# EAGLE design board (EAGLE 7.1.0)
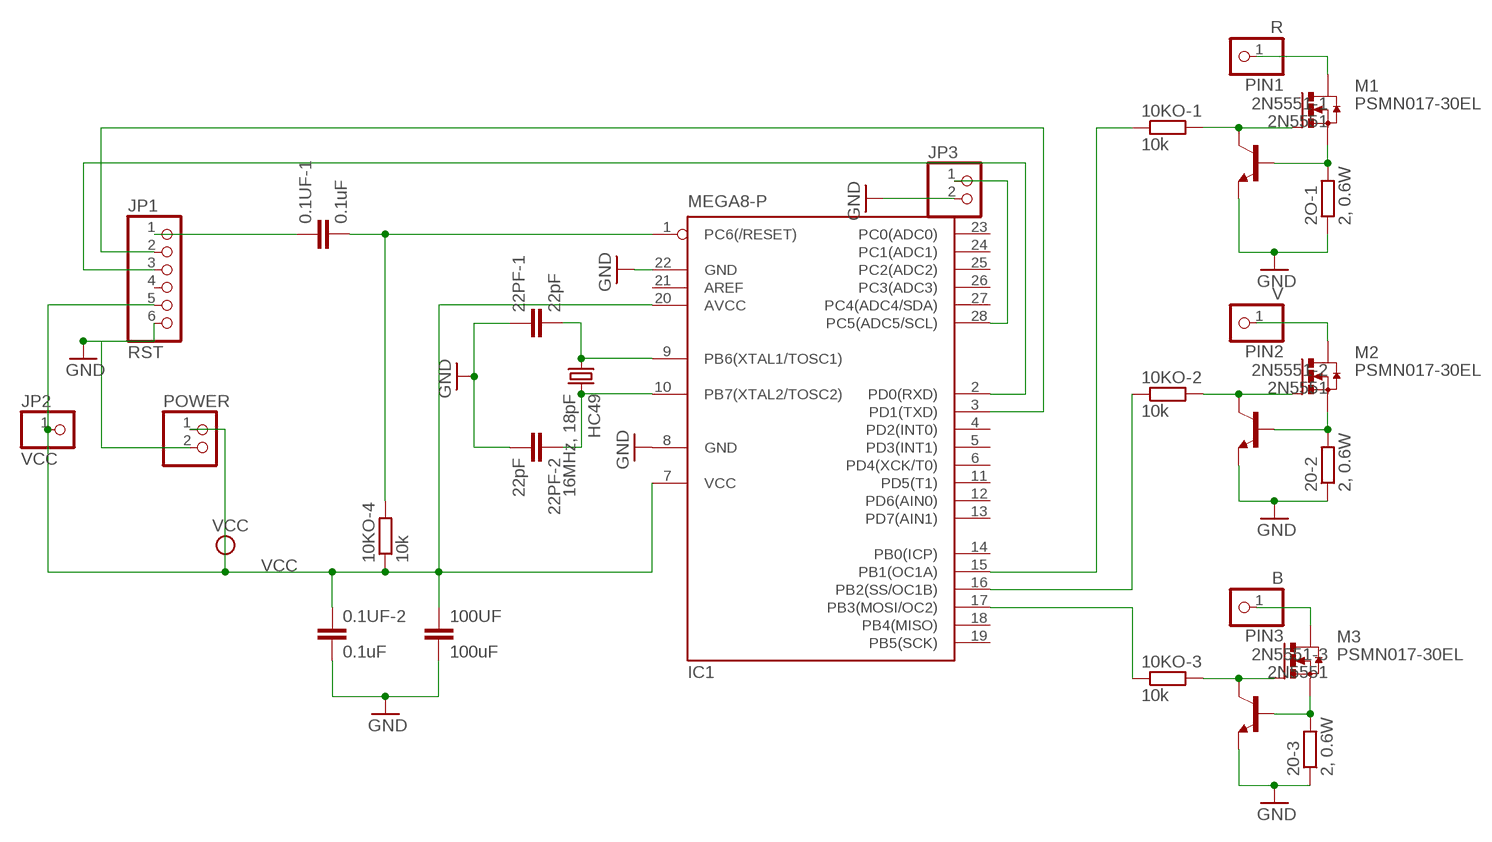
[diagram p0: schematic, sheet 1]

## Parts
0.1UF-1  0.1uF  C-EU025-030X050  [C025-030X050]
0.1UF-2  0.1uF  C-EU025-030X050  [C025-030X050]
2N5551-1  2N5551  2N5551-NPN-TO92-CBE  [TO92-CBE]
2N5551-2  2N5551  2N5551-NPN-TO92-CBE  [TO92-CBE]
2N5551-3  2N5551  2N5551-NPN-TO92-CBE  [TO92-CBE]
2O-1  2, 0.6W  R-EU_0309/V  [0309V]
10KO-1  10k  R-EU_0207/2V  [0207/2V]
10KO-2  10k  R-EU_0207/2V  [0207/2V]
10KO-3  10k  R-EU_0207/2V  [0207/2V]
10KO-4  10k  R-EU_0207/2V  [0207/2V]
20-2  2, 0.6W  R-EU_0309/V  [0309V]
20-3  2, 0.6W  R-EU_0309/V  [0309V]
22PF-1  22pF  C-EU025-030X050  [C025-030X050]
22PF-2  22pF  C-EU025-030X050  [C025-030X050]
100UF  100uF  C-EU025-050X050  [C025-050X050]
HC49  16MHz, 18pF  CRYSTALHC49S  [HC49/S]
IC1  MEGA8-P  [DIL28-3]
JP1  RST  PINHD-1X6  [1X06]
JP2  VCC  PINHD-1X1  [1X01]
JP3  PINHD-1X2  [1X02]
M1  PSMN017-30EL  PSMN017-30ELL-V  [TO262-V]
M2  PSMN017-30EL  PSMN017-30ELL-V  [TO262-V]
M3  PSMN017-30EL  PSMN017-30ELL-V  [TO262-V]
PIN1  R  PINHD-1X1  [1X01]
PIN2  V  PINHD-1X1  [1X01]
PIN3  B  PINHD-1X1  [1X01]
POWER  PINHD-1X2  [1X02]

## Nets
GND: 0.1UF-2.2 2N5551-1.E 2N5551-2.E 2N5551-3.E 2O-1.1 20-2.1 20-3.1 22PF-1.1 22PF-2.2 100UF.2 IC1.8(GND) IC1.22(GND) JP1.6 JP3.2 POWER.2
N$1: 22PF-1.2 HC49.1 IC1.9(PB6(XTAL1/TOSC1))
N$2: 22PF-2.1 HC49.2 IC1.10(PB7(XTAL2/TOSC2))
N$3: 0.1UF-1.1 JP1.1
N$4: 2N5551-2.C 10KO-2.2 M2.1(G)
N$5: 0.1UF-1.2 10KO-4.2 IC1.1(PC6(/RESET))
N$6: 2N5551-1.C 10KO-1.2 M1.1(G)
N$7: 2N5551-2.B 20-2.2 M2.3(S)
N$8: 2N5551-1.B 2O-1.2 M1.3(S)
N$9: IC1.3(PD1(TXD)) JP1.2
N$10: 2N5551-3.C 10KO-3.2 M3.1(G)
N$11: 2N5551-3.B 20-3.2 M3.3(S)
N$12: IC1.2(PD0(RXD)) JP1.3
N$13: 10KO-1.1 IC1.15(PB1(OC1A))
N$14: 10KO-2.1 IC1.16(PB2(SS/OC1B))
N$15: 10KO-3.1 IC1.17(PB3(MOSI/OC2))
N$16: M1.2(D) PIN1.1
N$17: M2.2(D) PIN2.1
N$18: M3.2(D) PIN3.1
N$19: IC1.28(PC5(ADC5/SCL)) JP3.1
VCC: 0.1UF-2.1 10KO-4.1 100UF.1 IC1.7(VCC) IC1.20(AVCC) JP1.5 JP2.1 POWER.1
Unconnected: IC1.4(PD2(INT0)) IC1.5(PD3(INT1)) IC1.6(PD4(XCK/T0)) IC1.11(PD5(T1)) IC1.12(PD6(AIN0)) IC1.13(PD7(AIN1)) IC1.14(PB0(ICP)) IC1.18(PB4(MISO)) IC1.19(PB5(SCK)) IC1.21(AREF) IC1.23(PC0(ADC0)) IC1.24(PC1(ADC1)) IC1.25(PC2(ADC2)) IC1.26(PC3(ADC3)) IC1.27(PC4(ADC4/SDA)) JP1.4

## Library data of the parts
0.1UF-1 0.1UF-2 22PF-1 22PF-2 100UF = rcl:C-EU: CAPACITOR, European symbol
2N5551-1-2N5551-3 = transistor:*-NPN-: NPN Transistror BF959 corrected 2008.03.06
2O-1 10KO-1-10KO-4 20-2 20-3 = rcl:R-EU_: RESISTOR, European symbol
HC49 = crystal:CRYSTAL: CRYSTAL; OC_FARNELL: 1667008; OC_NEWARK: unknown
IC1 = atmel:MEGA8-P: MICROCONTROLLER 8 Kbytes FLASH, 1 kbytes SRAM, 512 bytes EEPROM, USART, 4-channel 10 bit ADC, 2-channel 8 bit ADC Pin compatible with Atmega48, ATMega88, ATMega168 Source: avr.lbr; OC_FARNELL: unknown; OC_NEWARK: unknown
JP1 = pinhead:PINHD-1X6: PIN HEADER
JP2 PIN1-PIN3 = pinhead:PINHD-1X1: PIN HEADER
JP3 POWER = pinhead:PINHD-1X2: PIN HEADER
M1-M3 = hackens:PSMN017-30EL: MOSFET CANAL N 30V 32A I2PAK Source : http://www.farnell.com/datasheets/1596017.pdf

## Board
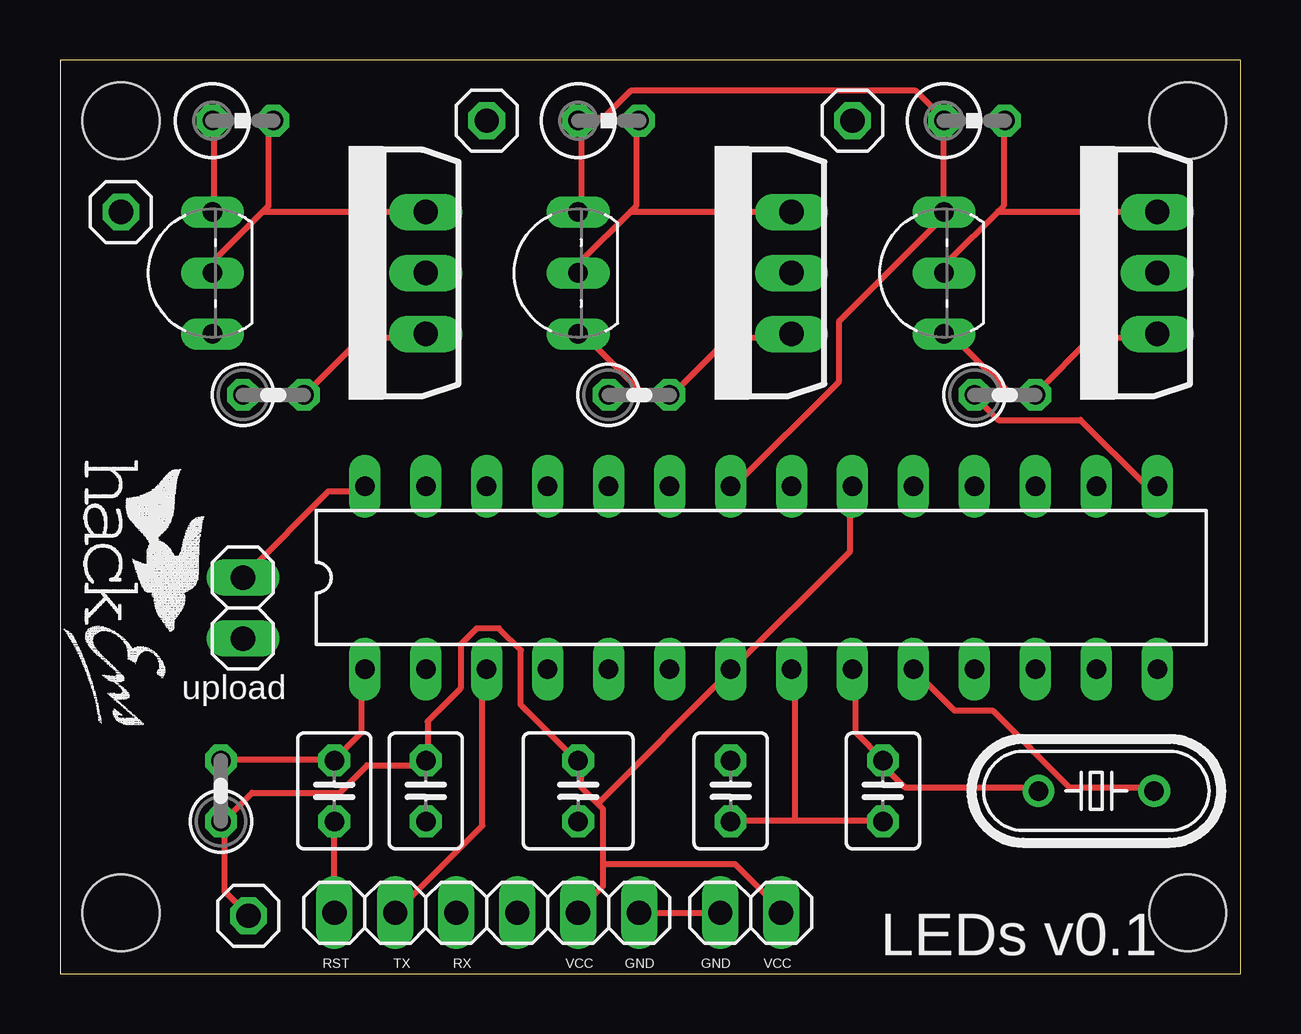
[diagram p1: board, top side]
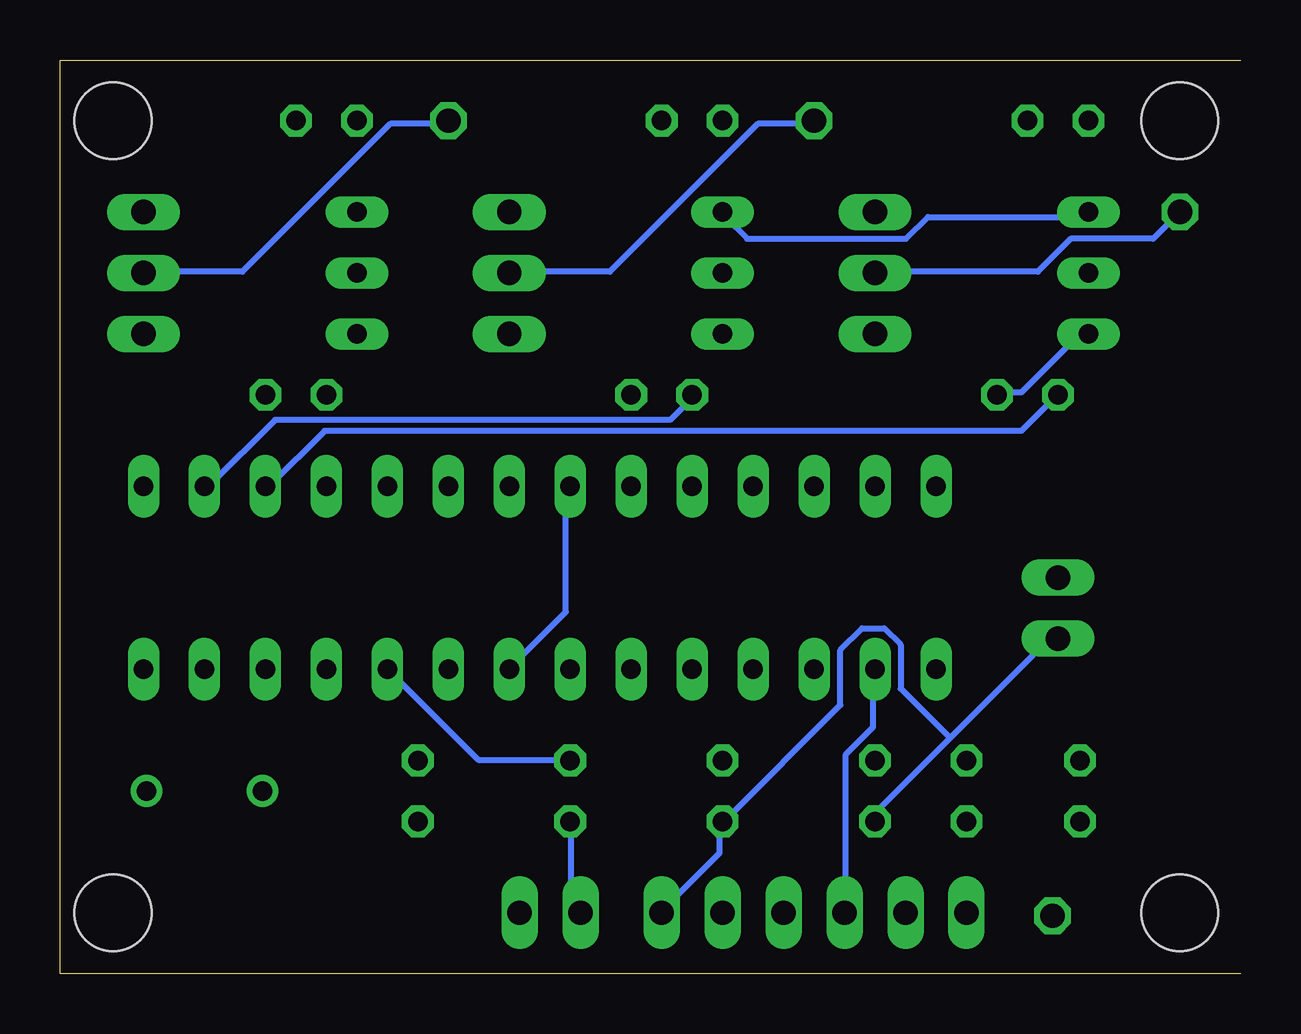
[diagram p2: board, bottom side, seen from below]

Size 49.2 x 38.09 mm. Coordinates in mm from the lower left corner, seen from the top.
Outline: 0,0 49.2,0 49.2,38.09 0,38.09
Copper layers (1*16): Top 0.035mm / dielectric 1.5mm / Bottom 0.035mm
Design rules "default": minimum track width 10mil, minimum drill 24mil, track to track 8mil, track to pad 8mil, pad to pad 8mil, via to via 8mil, smd to smd 8mil, copper to edge 40mil, drill to drill 8mil, minimum pad ring 10mil, minimum via ring 8mil, stop-mask expansion 4mil, vias tented up to drill 0mil, thermal gap 10mil
Holes 3.2 mm at 46.99,35.56 46.99,2.54 2.54,2.54 2.54,35.56

### Footprints (pad centres in the part's own frame; a part is rotated, then mirrored left to right if it is on the bottom)
C025-030X050 = drill 0.813 octagon: 1 -1.27,0; 2 1.27,0
TO92-CBE = drill 0.813 long: B 0,0; C -2.54,0; E 2.54,0
0309V = drill 0.813 octagon: 1 -1.27,0; 2 1.27,0
0207/2V = drill 0.813 octagon: 1 -1.27,0; 2 1.27,0
C025-050X050 = drill 0.813 octagon: 1 -1.27,0; 2 1.27,0
HC49/S = drill 0.813: 1 -2.413,0; 2 2.413,0
DIL28-3 = drill 0.813 long: 1 -16.51,-3.81; 2 -13.97,-3.81; 3 -11.43,-3.81; 4 -8.89,-3.81; 5 -6.35,-3.81; 6 -3.81,-3.81; 7 -1.27,-3.81; 8 1.27,-3.81; 9 3.81,-3.81; 10 6.35,-3.81; 11 8.89,-3.81; 12 11.43,-3.81; 13 13.97,-3.81; 14 16.51,-3.81; 15 16.51,3.81; 16 13.97,3.81; 17 11.43,3.81; 18 8.89,3.81; 19 6.35,3.81; 20 3.81,3.81; 21 1.27,3.81; 22 -1.27,3.81; 23 -3.81,3.81; 24 -6.35,3.81; 25 -8.89,3.81; 26 -11.43,3.81; 27 -13.97,3.81; 28 -16.51,3.81
1X06 = drill 1.016 long: 1 -6.35,0; 2 -3.81,0; 3 -1.27,0; 4 1.27,0; 5 3.81,0; 6 6.35,0
1X01 = drill 1.016 octagon: 1 0,0
1X02 = drill 1.016 long: 1 -1.27,0; 2 1.27,0
TO262-V = drill 1.016 long: 1 -2.54,0; 2 0,0; 3 2.54,0

### Placement (x,y rotation side)
0.1UF-1  11.43,7.62 90 top
0.1UF-2  15.24,7.62 270 top
2N5551-1  36.83,29.21 90 top
2N5551-2  21.59,29.21 90 top
2N5551-3  6.35,29.21 90 top
2O-1  38.1,35.56 0 top
10KO-1  39.37,24.13 0 top
10KO-2  24.13,24.13 0 top
10KO-3  8.89,24.13 0 top
10KO-4  6.71,7.62 90 top
20-2  22.86,35.56 0 top
20-3  7.62,35.56 0 top
22PF-1  34.29,7.62 90 top
22PF-2  27.94,7.62 270 top
100UF  21.59,7.62 270 top
HC49  43.18,7.62 0 top
IC1  29.21,16.51 0 top
JP1  17.78,2.54 0 top
JP2  7.85,2.41 0 top
JP3  7.62,15.24 270 top
M1  45.72,29.21 90 top
M2  30.48,29.21 90 top
M3  15.24,29.21 90 top
PIN1  33.02,35.56 0 top
PIN2  17.78,35.56 0 top
PIN3  2.54,31.75 0 top
POWER  28.78,2.54 180 top
U$1  [HACKENS-LOGO]  0,21.59 270 top

### Tracks (layer width: path | path; a pad name or v marks a point on that pad's centre or on a via)
GND
  Top 0.254: 2N5551-3.E 6.4,31.77 6.4,35.43 20-3.1 | 2N5551-2.E 21.72,31.77 21.72,35.43 20-2.1 21.72,35.66 22.63,35.66 23.77,36.8 35.66,36.8 36.8,35.66 2O-1.1 36.8,35.43 36.8,31.77 2N5551-1.E 36.8,31.55 32.46,27.2 32.46,24.69 28.12,20.34 IC1.22 | 30.63,6.4 28.12,6.4 22PF-2.2 | 30.63,6.4 34.29,6.4 22PF-1.1 | 30.63,6.4 30.63,12.57 IC1.8 | JP1.6 24.23,2.52 27.43,2.52 POWER.2
  Bottom 0.254: 2N5551-3.E 6.4,31.55 13.03,31.55 13.95,30.63 20.57,30.63 21.49,31.55 2N5551-2.E | 12.12,9.83 7.77,14.17 JP3.2 | 12.12,9.83 15.09,6.86 15.09,6.4 0.1UF-2.2 | JP1.6 24,2.74 21.72,5.03 21.72,6.17 100UF.2 21.49,6.4 16.69,11.2 16.69,13.49 15.77,14.4 14.86,14.4 14.17,13.72 14.17,11.89 12.12,9.83 | 22PF-2.2 27.89,6.17 27.89,2.97 27.66,2.74 POWER.2 | IC1.22 28.12,20.12 28.12,15.09 30.4,12.8 IC1.8
N$1
  Top 0.254: IC1.9 33.15,12.57 33.15,10.06 34.29,8.91 22PF-1.2 34.29,8.69 35.2,7.77 40.69,7.77 HC49.1
N$2
  Top 0.254: HC49.2 45.49,7.77 42.06,7.77 38.86,10.97 37.26,10.97 35.66,12.57 IC1.10
  Bottom 0.254: IC1.10 31.77,8.91 28.12,8.91 22PF-2.1
N$3
  Top 0.254: JP1.1 0.1UF-1.1
N$4
  Top 0.254: 2N5551-2.C 21.72,26.75 24.23,24.23 25.38,24.23 10KO-2.2 25.6,24.23 27.89,26.52 30.4,26.52 M2.1
N$5
  Top 0.254: 11.43,8.91 6.86,8.91 10KO-4.2 | 11.43,8.91 12.57,10.06 12.57,12.57 IC1.1 | 11.43,8.91 0.1UF-1.2
N$6
  Top 0.254: 2N5551-1.C 37.03,26.75 39.55,24.23 40.46,24.23 10KO-1.2 40.69,24.23 42.98,26.52 45.72,26.52 M1.1
N$7
  Top 0.254: 23.77,31.77 24,32 24,35.43 20-2.2 | 23.77,31.77 21.72,29.72 21.72,29.26 2N5551-2.B | 23.77,31.77 30.4,31.77 M2.3
N$8
  Top 0.254: 39.09,31.77 39.32,32 39.32,35.43 2O-1.2 | 39.09,31.77 37.03,29.72 37.03,29.26 2N5551-1.B | 39.09,31.77 45.72,31.77 M1.3
N$9
  Top 0.254: JP1.2 17.6,6.17 17.6,12.57 IC1.3
N$10
  Top 0.254: M3.1 15.09,26.52 12.57,26.52 10.29,24.23 10KO-3.2
  Bottom 0.254: 10KO-3.2 10.06,24.23 9.14,24.23 6.86,26.52 6.4,26.52 2N5551-3.C
N$11
  Top 0.254: 8.46,31.77 8.69,32 8.69,35.43 20-3.2 | 8.46,31.77 6.4,29.72 6.4,29.26 2N5551-3.B | 8.46,31.77 15.09,31.77 M3.3
N$12
  Bottom 0.254: IC1.2 15.32,12.57 15.32,10.29 16.46,9.14 16.46,2.74 JP1.3
N$13
  Top 0.254: IC1.15 45.72,20.34 45.26,20.34 42.52,23.09 39.09,23.09 38.18,24 10KO-1.1
N$14
  Bottom 0.254: IC1.16 42.98,20.34 40.23,23.09 23.77,23.09 22.86,24 10KO-2.1
N$15
  Bottom 0.254: IC1.17 40.46,20.34 38.18,22.63 9.14,22.63 7.77,24 10KO-3.1
N$16
  Bottom 0.254: M1.2 45.72,29.26 41.6,29.26 35.43,35.43 33.15,35.43 PIN1.1
N$17
  Bottom 0.254: M2.2 30.4,29.26 26.29,29.26 20.12,35.43 17.83,35.43 PIN2.1
N$18
  Bottom 0.254: PIN3.1 3.66,30.63 7.09,30.63 8.46,29.26 15.09,29.26 M3.2
N$19
  Top 0.254: IC1.28 12.57,20.12 11.2,20.12 7.77,16.69 JP3.1
VCC
  Top 0.254: JP2.1 7.77,2.52 6.86,3.43 6.86,6.17 10KO-4.1 6.86,6.4 8,7.54 11.66,7.54 12.8,8.69 15.09,8.69 0.1UF-2.1 15.32,8.91 15.32,10.52 16.69,11.89 16.69,13.72 17.37,14.4 18.29,14.4 19.2,13.49 19.2,11.2 21.49,8.91 100UF.1 21.72,8.69 21.72,7.77 22.4,7.09 | 22.4,7.09 22.63,6.86 22.63,4.57 | 22.63,4.57 22.63,3.66 21.72,2.74 JP1.5 | 22.4,7.09 27.89,12.57 IC1.7 28.12,12.8 32.92,17.6 32.92,20.12 IC1.20 | 22.63,4.57 28.12,4.57 29.95,2.74 POWER.1

### Text on the board
tPlace: upload | LEDs v0.1 | RST | TX | RX | VCC | GND | GND | VCC